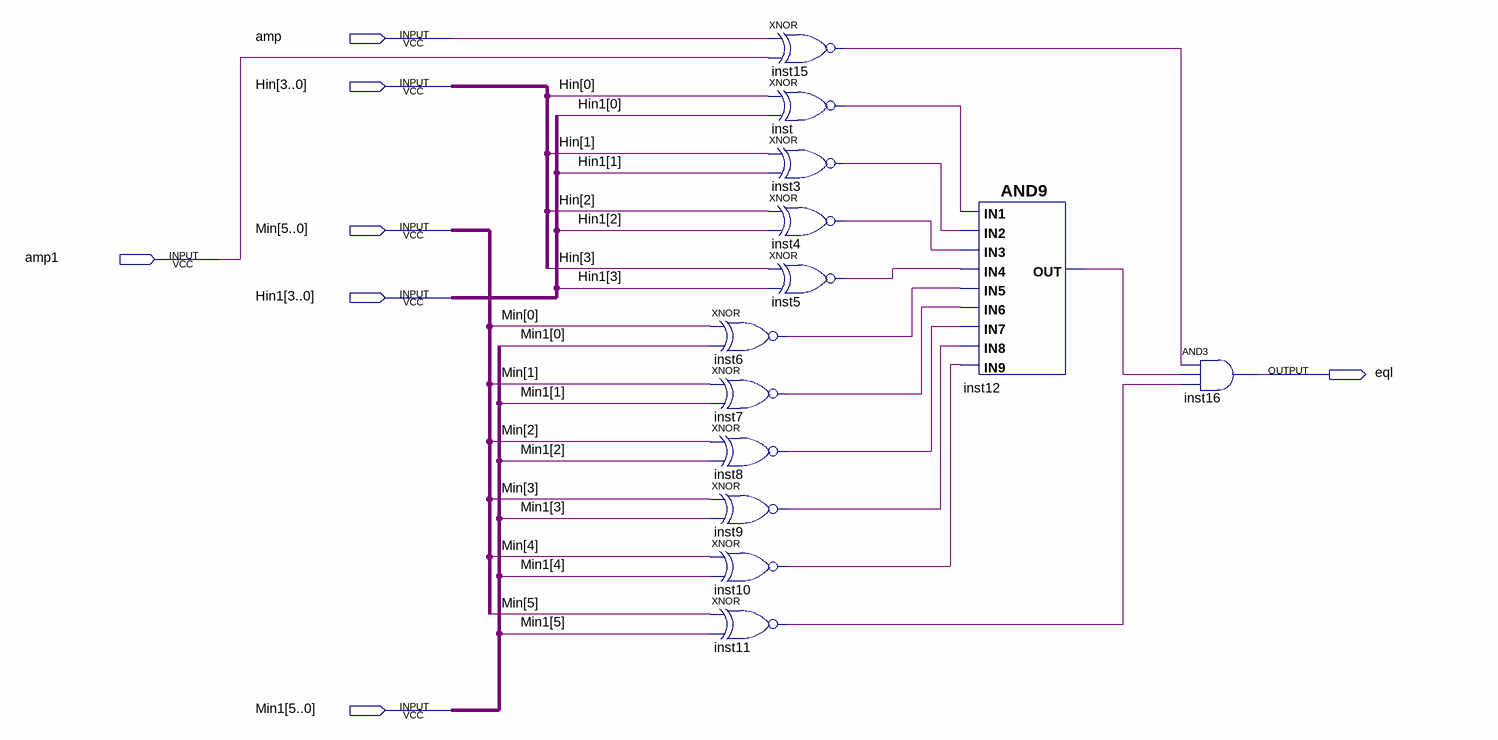
[diagram p0: schematic sheet]
// Quartus schematic timeCompare.bdf as structural Verilog: 13 symbols, 7 pins
module timeCompare (
  input  amp,
  input  [3:0] Hin,
  input  [5:0] Min,
  input  amp1,
  input  [3:0] Hin1,
  input  [5:0] Min1,
  output eql
);

  wire inst3_out, inst4_out, inst5_out, inst6_out, inst7_out, inst8_out, inst9_out, inst10_out, inst11_out,
       inst12_out, inst15_out, inst_out;

  xnor inst6 (inst6_out, Min[0], Min1[0]);
  xnor inst7 (inst7_out, Min[1], Min1[1]);
  xnor inst8 (inst8_out, Min[2], Min1[2]);
  xnor inst9 (inst9_out, Min[3], Min1[3]);
  xnor inst10 (inst10_out, Min[4], Min1[4]);
  xnor inst11 (inst11_out, Min[5], Min1[5]);
  xnor inst15 (inst15_out, amp, amp1);
  xnor inst (inst_out, Hin[0], Hin1[0]);
  xnor inst3 (inst3_out, Hin[1], Hin1[1]);
  xnor inst4 (inst4_out, Hin[2], Hin1[2]);
  xnor inst5 (inst5_out, Hin[3], Hin1[3]);
  and inst12 (inst12_out, inst_out, inst3_out, inst4_out, inst5_out, inst6_out, inst7_out, inst8_out, inst9_out, inst10_out);
  and inst16 (eql, inst15_out, inst12_out, inst11_out);
endmodule
